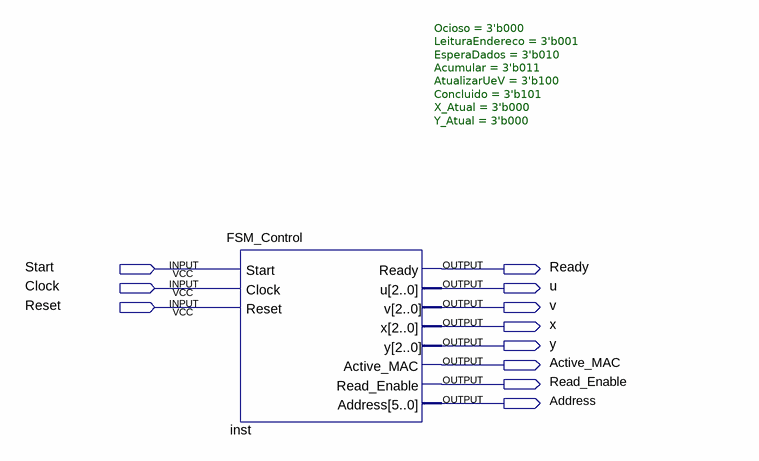
[diagram p0: schematic sheet]
// Quartus schematic FSM_Control.bdf as structural Verilog: 1 symbols, 11 pins
module FSM_Control (
  input  Start,
  input  Clock,
  input  Reset,
  output Ready,
  output u,
  output v,
  output x,
  output y,
  output Active_MAC,
  output Read_Enable,
  output Address
);

  FSM_Control #(.Ocioso(3'b000), .LeituraEndereco(3'b001), .EsperaDados(3'b010), .Acumular(3'b011), .AtualizarUeV(3'b100), .Concluido(3'b101), .X_Atual(3'b000), .Y_Atual(3'b000)) inst (
    .Start(Start), .Clock(Clock), .Reset(Reset), .Ready(Ready), .u(u), .v(v), .x(x), .y(y),
    .Active_MAC(Active_MAC), .Read_Enable(Read_Enable), .Address(Address));
endmodule
